# EAGLE design F3-Hexa-Brushed-SIDE-USB (EAGLE 7.5.0)
Title: F3 Hexa Brushed - Side USB Author: Lance Source: Alienflight.com License: CC BY SA <http://creativecommons.org/licenses/by-sa/4.0/>
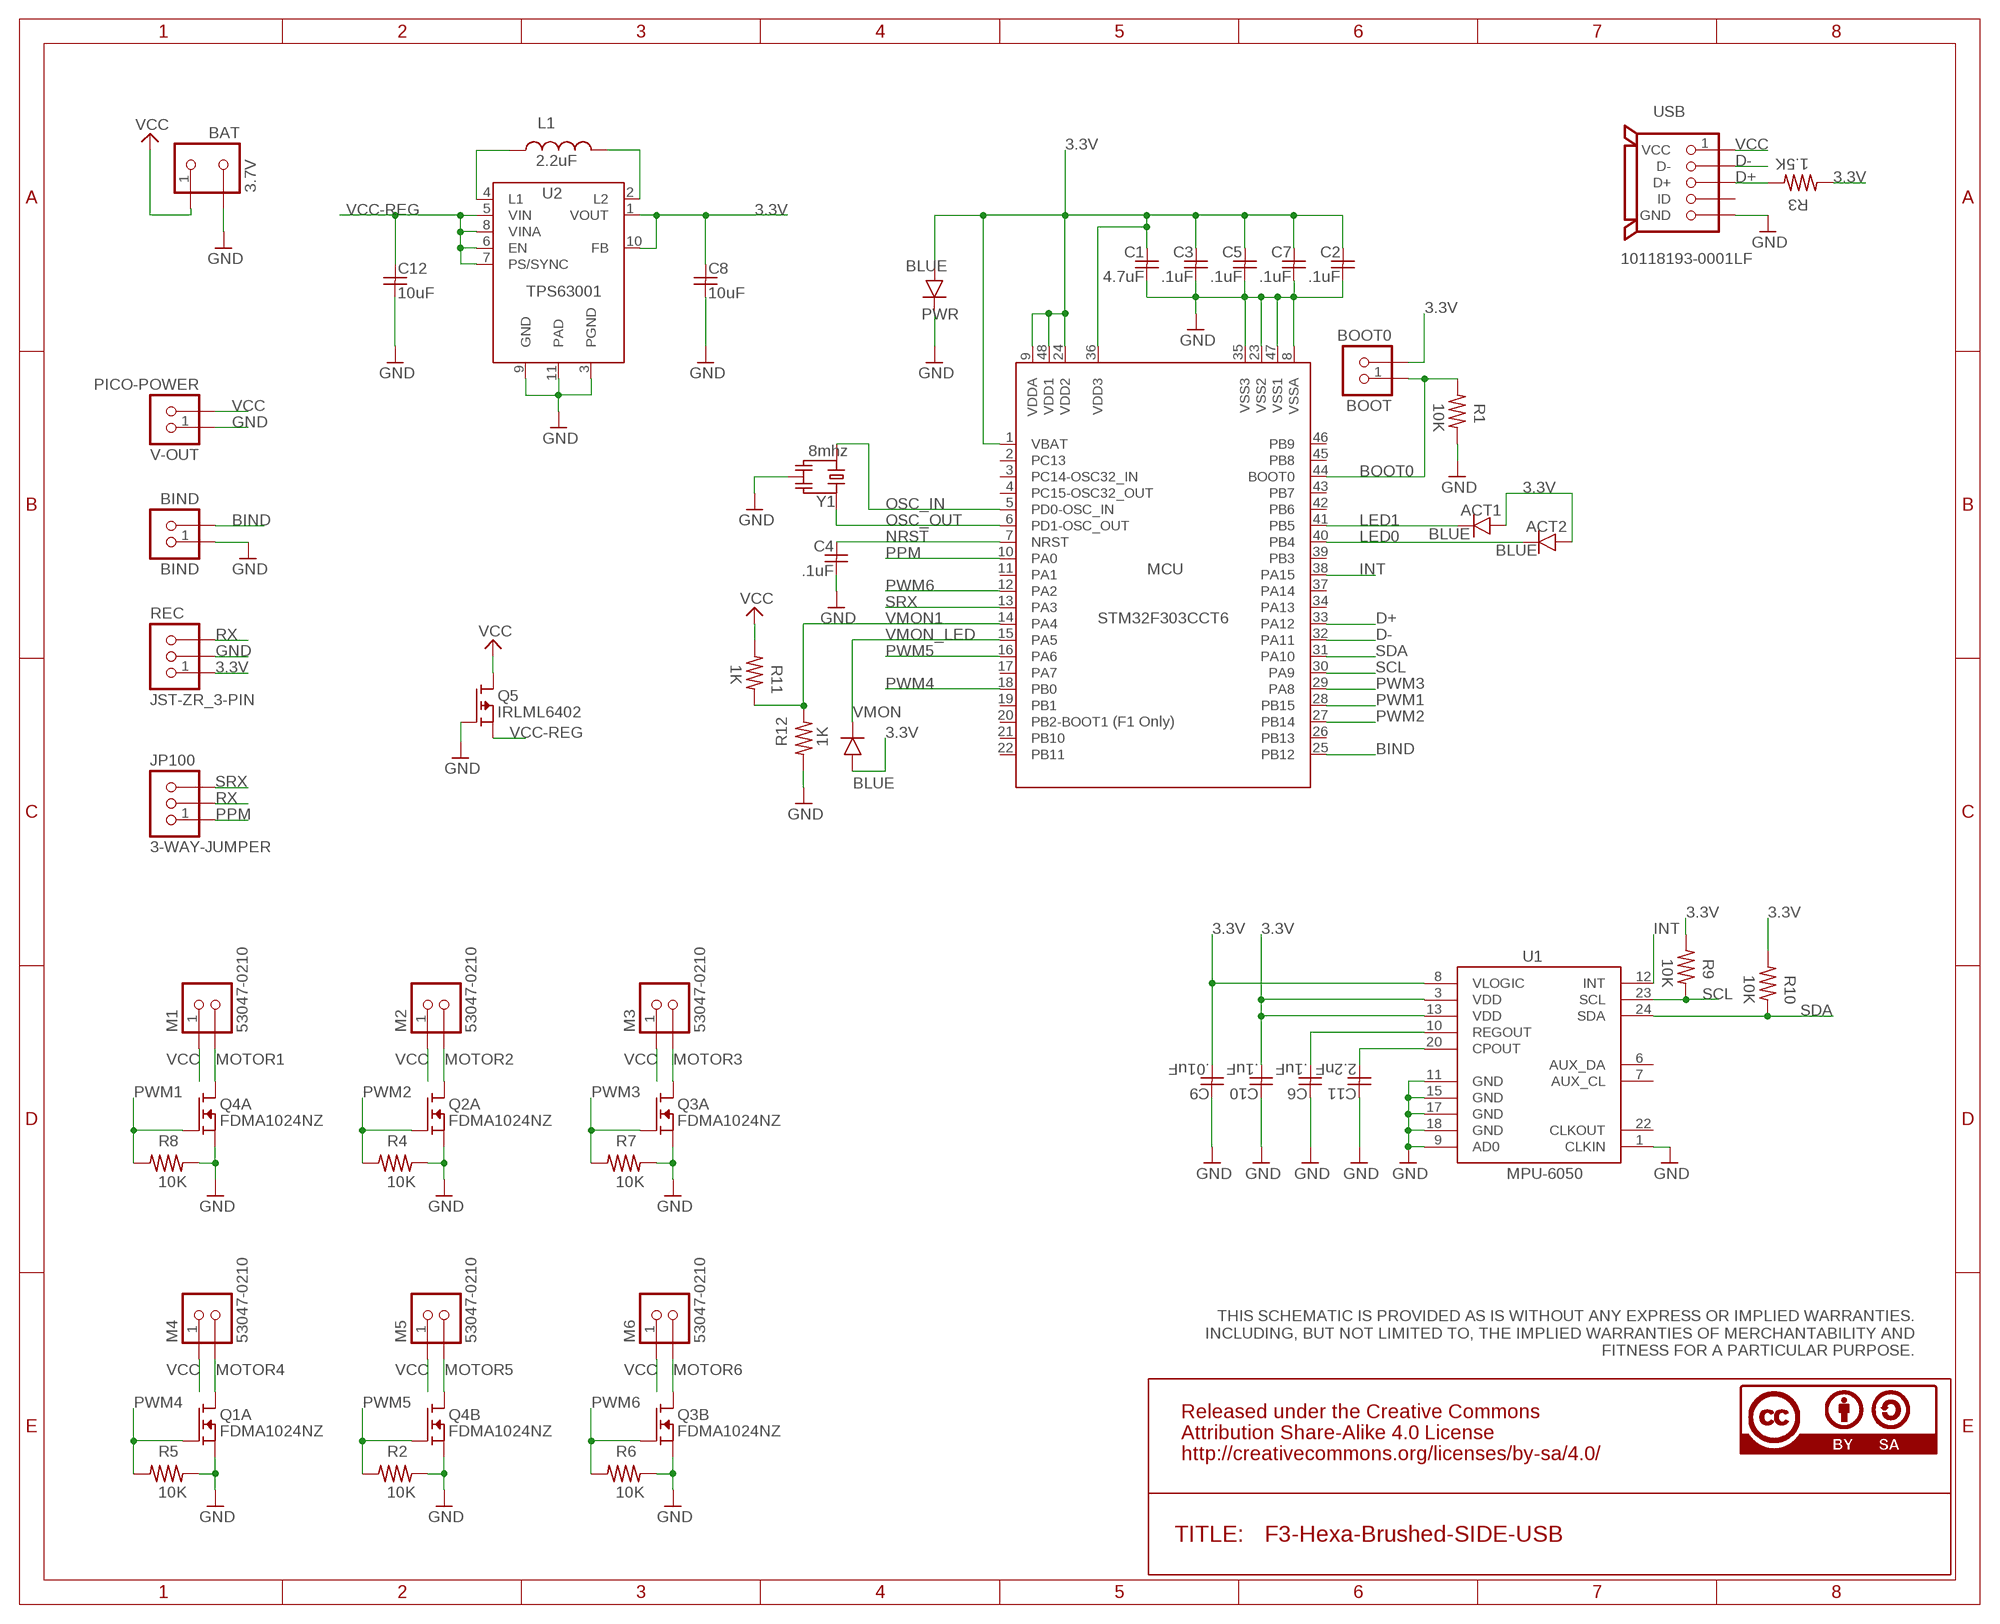
[diagram p0: schematic, sheet 1]

## Parts
ACT1  BLUE  SMD-CHIP-LED-0805  [SMD-CHIP-LED-0805]
ACT2  BLUE  SMD-CHIP-LED-0805  [SMD-CHIP-LED-0805]
BAT  3.7V  JST-PH-BAT  [S2B-PH-K-S]
BIND  BIND  TACTILE-SWITCH  [B3U-1000P(M)]
BOOT  BOOT0  TACTILE-SWITCH  [B3U-1000P(M)]
C1  4.7uF  CAPACITOR4.7UF  [MUR-CAP-0603]
C2  .1uF  CAPACITOR.1UF  [MUR-CAP-0603]
C3  .1uF  CAPACITOR.1UF  [MUR-CAP-0603]
C4  .1uF  CAPACITOR.1UF  [MUR-CAP-0603]
C5  .1uF  CAPACITOR.1UF  [MUR-CAP-0603]
C6  .1uF  CAPACITOR.1UF  [MUR-CAP-0603]
C7  .1uF  CAPACITOR.1UF  [MUR-CAP-0603]
C8  10uF  CAPACITOR10UF  [YUDEN-CAP-0805]
C9  .01uF  CAPACITOR.01UF  [MUR-CAP-0603]
C10  .1uF  CAPACITOR.1UF  [MUR-CAP-0603]
C11  2.2nF  CAPACITOR2.2NF  [MUR-CAP-0603]
C12  10uF  CAPACITOR10UF  [YUDEN-CAP-0805]
JP100  3-WAY-JUMPER  [3-WAY-JUMPER]
L1  2.2uF  NR301X  [NR301X]
M1  53047-0210  PICO-1.25-MOTOR  [PICO-53047-02]
M2  53047-0210  PICO-1.25-MOTOR  [PICO-53047-02]
M3  53047-0210  PICO-1.25-MOTOR  [PICO-53047-02]
M4  53047-0210  PICO-1.25-MOTOR  [PICO-53047-02]
M5  53047-0210  PICO-1.25-MOTOR  [PICO-53047-02]
M6  53047-0210  PICO-1.25-MOTOR  [PICO-53047-02]
MCU  STM32F303CCT6  STM32FX03-F3  [LQFP48-7X7]
PWR  BLUE  SMD-CHIP-LED-0805  [SMD-CHIP-LED-0805]
Q1  FDMA1024NZ  [MICROFET-2X2_DUAL]
Q2  FDMA1024NZ  [MICROFET-2X2_DUAL]
Q3  FDMA1024NZ  [MICROFET-2X2_DUAL]
Q4  FDMA1024NZ  [MICROFET-2X2_DUAL]
Q5  IRLML6402  MOSFET-P  [SOT-23]
R1  10K  RESISTOR10K  [VISH-RES-0603]
R2  10K  RESISTOR10K  [VISH-RES-0603]
R3  1.5K  RESISTOR1.5K  [VISH-RES-0603]
R4  10K  RESISTOR10K  [VISH-RES-0603]
R5  10K  RESISTOR10K  [VISH-RES-0603]
R6  10K  RESISTOR10K  [VISH-RES-0603]
R7  10K  RESISTOR10K  [VISH-RES-0603]
R8  10K  RESISTOR10K  [VISH-RES-0603]
R9  10K  RESISTOR10K  [VISH-RES-0603]
R10  10K  RESISTOR10K  [VISH-RES-0603]
R11  1K  RESISTOR1K  [VISH-RES-0603]
R12  1K  RESISTOR1K  [VISH-RES-0603]
REC  JST-ZR_3-PIN  [S3B-ZR]
U1  MPU-6050  [QFN24-4X4]
U2  TPS63001  TPS630XX-TPS63001  [VSON-N10]
USB  10118193-0001LF  USB-MICRO-B-FCI  [10118193-0001LF]
V-OUT  PICO-POWER  [PICO_1.25_.5MM]
VMON  BLUE  SMD-CHIP-LED-0805  [SMD-CHIP-LED-0805]
Y1  8mhz  RESONATOR8MHZ  [RESONATOR_8]

## Nets
3.3V: ACT1.A ACT2.A BOOT.2 C1.1 C2.1 C3.1 C5.1 C7.1 C8.1 C9.2 C10.2 MCU.1(VBAT) MCU.9(VDDA) MCU.24(VDD2) MCU.36(VDD3) MCU.48(VDD1) PWR.A R3.2 R9.2 R10.2 REC.1 U1.3(VDD) U1.8(VLOGIC) U1.13(VDD) U2.1(VOUT) U2.10(FB) VMON.A
BIND: BIND.2 MCU.25(PB12)
BOOT0: BOOT.1 MCU.44(BOOT0) R1.2
D+: MCU.33(PA12) R3.1 USB.3(D+)
D-: MCU.32(PA11) USB.2(D-)
GND: BAT.2 BIND.1 C1.2 C2.2 C3.2 C4.2 C5.2 C6.1 C7.2 C8.2 C9.1 C10.1 C11.1 C12.2 MCU.8(VSSA) MCU.23(VSS2) MCU.35(VSS3) MCU.47(VSS1) PWR.C Q1.A.S(A:S) Q2.A.S(A:S) Q3.A.S(A:S) Q3.B.S(B:S) Q4.A.S(A:S) Q4.B.S(B:S) Q5.1(G) R1.1 R2.1 R4.1 R5.1 R6.1 R7.1 R8.1 R12.2 REC.2 U1.1(CLKIN) U1.9(AD0) U1.11(GND) U1.15(GND) U1.17(GND) U1.18(GND) U2.3(PGND) U2.9(GND) U2.11(PAD) USB.5(GND) USB.GND USB.GND2(GND) USB.HOLE1(GND) USB.HOLE2(GND) V-OUT.1 Y1.2
INT: MCU.38(PA15) U1.12(INT)
LED0: ACT2.C MCU.40(PB4)
LED1: ACT1.C MCU.41(PB5)
MOTOR1: M1.2 Q4.A.D1(A:D) Q4.A.D(A:D)
MOTOR2: M2.2 Q2.A.D1(A:D) Q2.A.D(A:D)
MOTOR3: M3.2 Q3.A.D1(A:D) Q3.A.D(A:D)
MOTOR4: M4.2 Q1.A.D1(A:D) Q1.A.D(A:D)
MOTOR5: M5.2 Q4.B.D1(B:D) Q4.B.D(B:D)
MOTOR6: M6.2 Q3.B.D1(B:D) Q3.B.D(B:D)
N$1: C6.2 U1.10(REGOUT)
N$7: C11.2 U1.20(CPOUT)
N$8: L1.2 U2.2(L2)
N$9: L1.1 U2.4(L1)
NRST: C4.1 MCU.7(NRST)
OSC_IN: MCU.5(PD0-OSC_IN) Y1.3
OSC_OUT: MCU.6(PD1-OSC_OUT) Y1.1
PPM: JP100.1 MCU.10(PA0)
PWM1: MCU.28(PB15) Q4.A.G(A:G) R8.2
PWM2: MCU.27(PB14) Q2.A.G(A:G) R4.2
PWM3: MCU.29(PA8) Q3.A.G(A:G) R7.2
PWM4: MCU.18(PB0) Q1.A.G(A:G) R5.2
PWM5: MCU.16(PA6) Q4.B.G(B:G) R2.2
PWM6: MCU.12(PA2) Q3.B.G(B:G) R6.2
RX: JP100.2 REC.3
SCL: MCU.30(PA9) R9.1 U1.23(SCL)
SDA: MCU.31(PA10) R10.1 U1.24(SDA)
SRX: JP100.3 MCU.13(PA3)
VCC [vcc]: BAT.1 M1.1 M2.1 M3.1 M4.1 M5.1 M6.1 Q5.3(D) R11.2 USB.1(VCC) V-OUT.2
VCC-REG [vcc]: C12.1 Q5.2(S) U2.5(VIN) U2.6(EN) U2.7(PS/SYNC) U2.8(VINA)
VMON1: MCU.14(PA4) R11.1 R12.1
VMON_LED: MCU.15(PA5) VMON.C
Unconnected: MCU.2(PC13) MCU.3(PC14-OSC32_IN) MCU.4(PC15-OSC32_OUT) MCU.11(PA1) MCU.17(PA7) MCU.19(PB1) MCU.20(PB2-BOOT1) MCU.21(PB10) MCU.22(PB11) MCU.26(PB13) MCU.34(PA13) MCU.37(PA14) MCU.39(PB3) MCU.42(PB6) MCU.43(PB7) MCU.45(PB8) MCU.46(PB9) Q1.B.D1(B:D) Q1.B.D(B:D) Q1.B.G(B:G) Q1.B.S(B:S) Q2.B.D1(B:D) Q2.B.D(B:D) Q2.B.G(B:G) Q2.B.S(B:S) U1.6(AUX_DA) U1.7(AUX_CL) U1.22(CLKOUT) USB.4(ID)

## Notes on the sheet
- THIS SCHEMATIC IS PROVIDED AS IS WITHOUT ANY EXPRESS OR IMPLIED WARRANTIES.
   INCLUDING, BUT NOT LIMITED TO, THE IMPLIED WARRANTIES OF MERCHANTABILITY AND
   FITNESS FOR A PARTICULAR PURPOSE.

## Library data of the parts
ACT1 ACT2 PWR VMON = alienflight:SMD-CHIP-LED-0805: SMD CHIP LED APHCM2012QBC/D-F01 View Datasheet <https://www.kingbrightusa.com/images/catalog/spec/APHCM2012QBC-D-F01.pdf> Author: Lance Source: http://alienflight.com License: CC BY SA <creativecommons.org/licenses/by-sa/4.0/>; MF: Kingbright; MPN: APHCM2012QBC/D-F01
BAT = alienflight:JST-PH-BAT: Battery Connector JST- S2B-PH-K-S View Datasheet <http://www.jst-mfg.com/product/pdf/eng/ePH.pdf> Author: Lance Source: http://alienflight.com License: CC BY SA <creativecommons.org/licenses/by-sa/4.0/>; MF: JST; MPN: S2B-PH-K-S
BIND BOOT = alienflight:TACTILE-SWITCH: Tactile Switch B3U-1000P Datasheet <https://www.omron.com/ecb/products/pdf/en-b3u.pdf> Author: Lance Source: http://alienflight.com License: CC BY SA <creativecommons.org/licenses/by-sa/4.0/>; MF: Omron; MPN: B3U-1000P
C1 = alienflight:CAPACITOR: CAPACITORS Murata Datasheet <http://www.murata.com/~/media/webrenewal/support/library/catalog/products/capacitor/mlcc/c02e.ashx?la=en-us> Taiyo Yuden Datasheet <http://www.mouser.com/ds/2/396/mlcc11_hq_e-541564.pdf> Author: Lance Source: http://alienflight.com License: CC BY SA <creativecommons.org/licenses/by-sa/4.0/>; MF: Murata; MPN: GRJ188C70J475KE11D
C2-C7 C10 = alienflight:CAPACITOR: CAPACITORS Murata Datasheet <http://www.murata.com/~/media/webrenewal/support/library/catalog/products/capacitor/mlcc/c02e.ashx?la=en-us> Taiyo Yuden Datasheet <http://www.mouser.com/ds/2/396/mlcc11_hq_e-541564.pdf> Author: Lance Source: http://alienflight.com License: CC BY SA <creativecommons.org/licenses/by-sa/4.0/>; MF: Murata; MPN: GRM188R71C104KA01D
C8 C12 = alienflight:CAPACITOR: CAPACITORS Murata Datasheet <http://www.murata.com/~/media/webrenewal/support/library/catalog/products/capacitor/mlcc/c02e.ashx?la=en-us> Taiyo Yuden Datasheet <http://www.mouser.com/ds/2/396/mlcc11_hq_e-541564.pdf> Author: Lance Source: http://alienflight.com License: CC BY SA <creativecommons.org/licenses/by-sa/4.0/>; MF: Taiyo Yuden; MPN: JMK212AB7106KG-T
C9 = alienflight:CAPACITOR: CAPACITORS Murata Datasheet <http://www.murata.com/~/media/webrenewal/support/library/catalog/products/capacitor/mlcc/c02e.ashx?la=en-us> Taiyo Yuden Datasheet <http://www.mouser.com/ds/2/396/mlcc11_hq_e-541564.pdf> Author: Lance Source: http://alienflight.com License: CC BY SA <creativecommons.org/licenses/by-sa/4.0/>; MF: Murata; MPN: GRM188R71C103KA01D
C11 = alienflight:CAPACITOR: CAPACITORS Murata Datasheet <http://www.murata.com/~/media/webrenewal/support/library/catalog/products/capacitor/mlcc/c02e.ashx?la=en-us> Taiyo Yuden Datasheet <http://www.mouser.com/ds/2/396/mlcc11_hq_e-541564.pdf> Author: Lance Source: http://alienflight.com License: CC BY SA <creativecommons.org/licenses/by-sa/4.0/>; MF: Murata; MPN: GRM188R71C222KA01D
JP100 = alienflight:3-WAY-JUMPER: 3 Way Jumper
L1 = alienflight:NR301X: 3X3mm Inductor NR3015T2R2M - Datasheet <http://datasheet.octopart.com/NR3015T2R2M-Taiyo-Yuden-datasheet-41181804.pdf> Author: Lance Source: http://alienflight.com License: CC BY SA <creativecommons.org/licenses/by-sa/4.0/>; MF: Taiyo Yuden; MPN: NR3015T2R2M
M1-M6 = alienflight:PICO-1.25-MOTOR: Motor Connector PicoBlade 1.25 53047-02 View Datasheet <http://www.molex.com/webdocs/datasheets/pdf/en-us/0530470210_PCB_HEADERS.pdf> Author: Lance Source: http://alienflight.com License: CC BY SA <creativecommons.org/licenses/by-sa/4.0/>; MF: MOLEX; MPN: 53047-0210
MCU = alienflight:STM32FX03: STM32F32FX03 Datasheet <http://www.st.com/web/en/resource/technical/document/datasheet/DM00058181.pdf> Author: Lance Source: http://alienflight.com License: CC BY SA <creativecommons.org/licenses/by-sa/4.0/>; MF: ST; MPN: STM32F303CCT6
Q1-Q4 = alienflight:FDMA1024NZ: Dual N-Channel MOSFET FDMA1024NZ View Datasheet <https://www.fairchildsemi.com/datasheets/FD/FDMA1024NZ.pdf> Author: Lance Source: Alienflight.com License: CC BY SA <creativecommons.org/licenses/by-sa/4.0/>; MF: Fairchild; MPN: FDMA1024NZ
Q5 = alienflight:MOSFET-P: P-Channel MOSFET IRLML6402 Datasheet <http://www.irf.com/product-info/datasheets/data/irlml6402pbf.pdf> Author: Lance Source: Alienflight.com License: CC BY SA <creativecommons.org/licenses/by-sa/4.0/>; MF: IR; MPN: IRLML6402
R1 R2 R4-R10 = alienflight:RESISTOR: RESISTORS Vishay DataSheet <http://www.vishay.com/docs/20043/crcwhpe3.pdf> Author: Lance Source: http://alienflight.com License: CC BY SA <creativecommons.org/licenses/by-sa/4.0/>; MF: Vishay; MPN: CRCW060310K0FKEAHP
R3 = alienflight:RESISTOR: RESISTORS Vishay DataSheet <http://www.vishay.com/docs/20043/crcwhpe3.pdf> Author: Lance Source: http://alienflight.com License: CC BY SA <creativecommons.org/licenses/by-sa/4.0/>; MF: Vishay; MPN: CRCW06031K50FKEAHP
R11 R12 = alienflight:RESISTOR: RESISTORS Vishay DataSheet <http://www.vishay.com/docs/20043/crcwhpe3.pdf> Author: Lance Source: http://alienflight.com License: CC BY SA <creativecommons.org/licenses/by-sa/4.0/>; MF: Vishay; MPN: CRCW06031K00FKEAHP
REC = alienflight:JST-ZR_3-PIN: 3 Pin Receiver JST - S3B-ZR View Datasheet <http://www.jst-mfg.com/product/pdf/eng/eZH.pdf> Author: Lance Source: http://alienflight.com License: CC BY SA <creativecommons.org/licenses/by-sa/4.0/>; MF: JST; MPN: S3B-ZR
U1 = alienflight:MPU-6050: MPU-6050 View Datasheet <http://43zrtwysvxb2gf29r5o0athu.wpengine.netdna-cdn.com/wp-content/uploads/2015/02/MPU-6000-Datasheet1.pdf> Author: Lance Source: http://alienflight.com License: CC BY SA <creativecommons.org/licenses/by-sa/4.0/>; MF: Invensense; MPN: MPU-6050
U2 = alienflight:TPS630XX: Buck/Boost Converter TPS63001/2 Datasheet <http://www.ti.com/lit/ds/symlink/tps63001.pdf> Author: Lance Source: http://alienflight.com License: CC BY SA <creativecommons.org/licenses/by-sa/4.0/>; MF: TI; MPN: TPS63001DRCR
USB = alienflight:USB-MICRO-B: Micro-B USB Connector Author: Lance Source: http://alienflight.com License: CC BY SA <creativecommons.org/licenses/by-sa/4.0/>; MF: FCI; MPN: 10118193-0001LF
V-OUT = alienflight:PICO-POWER: Pico Power Connector Picoblade 53047-0210 View Datasheet <http://www.molex.com/webdocs/datasheets/pdf/en-us/0530470210_PCB_HEADERS.pdf> Author: Lance Source: http://alienflight.com License: CC BY SA <creativecommons.org/licenses/by-sa/4.0/>; MF: Molex; MPN: 53047-0210
Y1 = alienflight:RESONATOR: SMD Ceramic Resonators Ceralock Murata Datasheet <http://www.murata.com/~/media/webrenewal/support/library/catalog/products/timingdevice/ceralock/p16e.ashx> Author: Lance Source: http://alienflight.com License: CC BY SA <creativecommons.org/licenses/by-sa/4.0/>; MF: Murata; MPN: CSTCE8M00G55-R0

## Net classes
0 default: width 0.254 mm, drill 0.33 mm, clearance 0.178 mm
1 vcc: width 0.254 mm, drill 0.33 mm, clearance 0.178 mm
2 gnd: width 0.254 mm, drill 0.33 mm, clearance 0.178 mm

## Board
Title: F3 Hexa Brushed - Side USB Author: Lance Source: Alienflight.com License: CC BY SA <http://creativecommons.org/licenses/by-sa/4.0/>
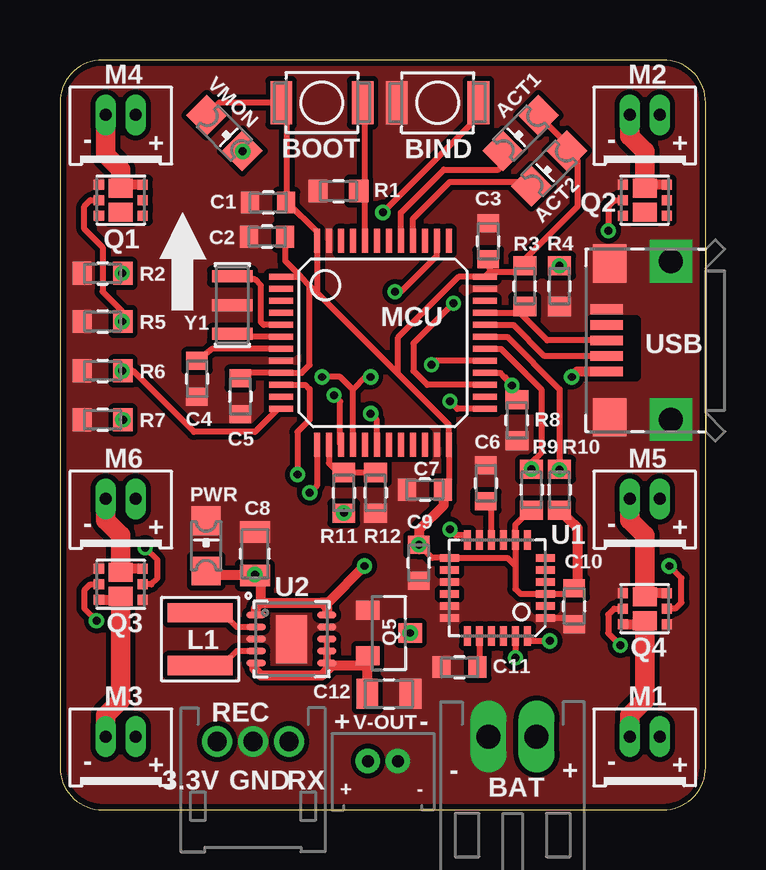
[diagram p1: board, top side]
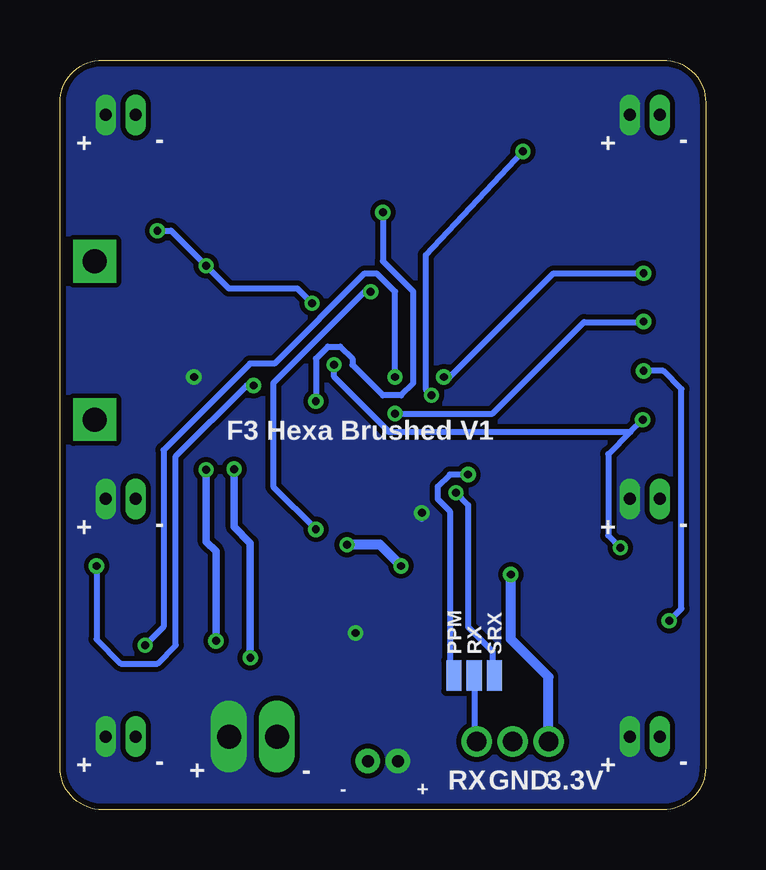
[diagram p2: board, bottom side, seen from below]

Size 26.92 x 31.24 mm. Coordinates in mm from the lower left corner, seen from the top.
Outline: 26.92,1.78 26.92,29.46 arc90 25.15,31.24 1.78,31.24 arc90 0,29.46 0,1.78 arc90 1.78,0 25.15,0 arc90 26.92,1.78
Copper layers (1*16): Top 0.035mm / dielectric 1.5mm / Bottom 0.035mm
Design rules "Alien-Design-Rules": minimum track width 6mil, minimum drill 12mil, track to track 6mil, track to pad 6mil, pad to pad 6mil, via to via 6mil, smd to smd 0mil, copper to edge 10mil, drill to drill 10mil, minimum pad ring 7mil, minimum via ring 6mil, stop-mask expansion 0mil, vias tented up to drill 20mil, thermal gap 10mil

### Footprints (pad centres in the part's own frame; a part is rotated, then mirrored left to right if it is on the bottom)
SMD-CHIP-LED-0805 = smd 1.2 x 1.2: A -1.05,0; C 1.05,0
S2B-PH-K-S = drill 1 long: 1 1,0; 2 -1,0
B3U-1000P(M) = smd 0.9 x 1.8: 1 -1.7,0; 2 1.7,0
MUR-CAP-0603 = smd 0.75 x 0.9: 1 -0.75,0; 2 0.75,0
YUDEN-CAP-0805 = smd 0.9 x 1.25: 1 -0.9,0; 2 0.9,0
3-WAY-JUMPER = smd 0.635 x 1.27: 1 -0.84,0; 2 0,0; 3 0.84,0
NR301X = smd 2.7 x 0.8: 1 0,1.1; 2 0,-1.1
PICO-53047-02 = drill 0.5 pad 0.813 long: 1 0.625,0; 2 -0.625,0
LQFP48-7X7 = smd 0.254 x 1: 1 -2.75,-4.25; 2 -2.25,-4.25; 3 -1.75,-4.25; 4 -1.25,-4.25; 5 -0.75,-4.25; 6 -0.25,-4.25; 7 0.25,-4.25; 8 0.75,-4.25; 9 1.25,-4.25; 10 1.75,-4.25; 11 2.25,-4.25; 12 2.75,-4.25; 25 2.75,4.25; 26 2.25,4.25; 27 1.75,4.25; 28 1.25,4.25; 29 0.75,4.25; 30 0.25,4.25; 31 -0.25,4.25; 32 -0.75,4.25; 33 -1.25,4.25; 34 -1.75,4.25; 35 -2.25,4.25; 36 -2.75,4.25 | smd 1 x 0.254: 13 4.25,-2.75; 14 4.25,-2.25; 15 4.25,-1.75; 16 4.25,-1.25; 17 4.25,-0.75; 18 4.25,-0.25; 19 4.25,0.25; 20 4.25,0.75; 21 4.25,1.25; 22 4.25,1.75; 23 4.25,2.25; 24 4.25,2.75; 37 -4.25,2.75; 38 -4.25,2.25; 39 -4.25,1.75; 40 -4.25,1.25; 41 -4.25,0.75; 42 -4.25,0.25; 43 -4.25,-0.25; 44 -4.25,-0.75; 45 -4.25,-1.25; 46 -4.25,-1.75; 47 -4.25,-2.25; 48 -4.25,-2.75
MICROFET-2X2_DUAL = smd 0.8 x 1: A.D 0.5,0; B.D -0.5,0 | smd 0.42 x 0.42: A.D1 0.65,-0.915; A.G 0,0.915; A.S 0.65,0.915; B.D1 -0.65,0.915; B.G 0,-0.915; B.S -0.65,-0.915
SOT-23 = smd 0.802 x 0.972: 1 -0.95,-0.885; 2 0.95,-0.885; 3 0,0.885
VISH-RES-0603 = smd 0.8 x 0.95: 1 -0.85,0; 2 0.85,0
S3B-ZR = drill 0.8 pad 1.27: 1 -1.5,0; 2 0,0; 3 1.5,0
QFN24-4X4 = smd 0.8 x 0.3: 1 -2,1.25; 2 -2,0.75; 3 -2,0.25; 4 -2,-0.25; 5 -2,-0.75; 6 -2,-1.25; 13 2,-1.25; 14 2,-0.75; 15 2,-0.25; 16 2,0.25; 17 2,0.75; 18 2,1.25 | smd 0.3 x 0.8: 7 -1.25,-2; 8 -0.75,-2; 9 -0.25,-2; 10 0.25,-2; 11 0.75,-2; 12 1.25,-2; 19 1.25,2; 20 0.75,2; 21 0.25,2; 22 -0.25,2; 23 -0.75,2; 24 -1.25,2
VSON-N10 = smd 0.8 x 0.26: 1 -1.475,1; 2 -1.475,0.5; 3 -1.475,0; 4 -1.475,-0.5; 5 -1.475,-1; 6 1.475,-1; 7 1.475,-0.5; 8 1.475,0; 9 1.475,0.5; 10 1.475,1 | smd 1.3 x 2: 11 0,0
10118193-0001LF = smd 0.4 x 1.35: 1 1.3,-4.125; 2 0.65,-4.125; 3 0,-4.125; 4 -0.65,-4.125; 5 -1.3,-4.125 | smd 1.6 x 1.4: GND -3.2,-4; GND2 3.2,-4 | drill 1 pad 1.778 square: HOLE1 -3.3,-1.45; HOLE2 3.3,-1.45
PICO_1.25_.5MM = drill 0.5 pad 1.016: 1 0.625,0; 2 -0.625,0
RESONATOR_8 = smd 0.5 x 1.7: 1 -1.2,0; 2 0,0; 3 1.2,0

### Placement (x,y rotation side)
ACT1  19.2,28.19 225 top
ACT2  20.4,26.72 225 top
BAT  18.87,3.05 0 top
BIND  15.75,29.46 0 top
BOOT  10.92,29.46 180 top
C1  8.69,25.3 180 top
C2  8.64,23.88 180 top
C3  17.86,23.7 90 top
C4  5.71,17.96 270 top
C5  7.52,17.22 270 top
C6  17.75,13.61 270 top
C7  15.21,13.34 180 top
C8  8.13,10.67 90 top
C9  14.96,10.29 90 top
C10  21.44,8.48 90 top
C11  16.66,5.94 0 top
C12  13.72,4.83 0 top
JP100  9.65,5.59 0 bottom
L1  5.84,7.11 180 top
M1  24.38,3.05 0 top
M2  24.38,28.96 0 top
M3  2.54,3.05 0 top
M4  2.54,28.96 0 top
M5  24.38,12.95 0 top
M6  2.54,12.95 0 top
MCU  13.46,19.46 270 top
PWR  6.1,11 90 top
Q1  2.54,25.4 90 top
Q2  24.38,25.4 90 top
Q3  2.54,9.4 270 top
Q4  24.38,8.38 270 top
Q5  13.72,7.37 270 top
R1  11.61,25.78 0 top
R2  1.78,22.35 0 top
R3  19.38,21.82 90 top
R4  20.83,21.82 90 top
R5  1.78,20.35 0 top
R6  1.78,18.29 0 top
R7  1.78,16.26 0 top
R8  19.05,16.23 90 top
R9  19.66,13.34 270 top
R10  20.83,13.34 270 top
R11  11.84,13.21 270 top
R12  13.16,13.21 270 top
REC  8.05,2.84 0 top
U1  18.24,9.25 180 top
U2  9.65,7.11 0 top
U$1  [ARROW]  5.08,22.35 0 top
USB  26.92,19.56 270 top
V-OUT  13.46,2.03 0 top
VMON  6.86,28.19 315 top
Y1  7.19,21.03 90 top

### Tracks (layer width: path | path; a pad name or v marks a point on that pad's centre or on a via)
3.3V  (via drill 0.33)
  Top 0.254: 21.51,9.26 C10.2 21.49,9 U1.3 19.2,9 18.99,9.21 18.99,10.16 | 18.99,10.16 U1.8 18.99,11.88 19.56,12.45 19.65,12.45 R9.2 | 18.99,10.16 18.65,10.5 U1.13 15.51,10.5 v14.96,11.05 | C3.1 17.93,22.43 | 17.93,22.43 MCU.36 16.62,22.21 14.1,19.68 14.1,18.16 | 10.71,21.55 MCU.48 10.71,24.09 9.5,25.3 C1.1 9.44,29.16 | 10.41,21.84 10.41,18.54 10.08,18.21 MCU.9 7.75,18.21 C5.1 | 17.93,22.43 19.14,22.43 R3.2 19.38,22.94 21.59,25.15 21.59,27.06 ACT2.A 21.24,27.64 ACT1.A | 14.96,10.9 14.99,10.92 14.99,10.81 14.97,10.81 v14.96,11.05 | 14.99,10.77 v14.96,11.05 | v14.96,11.05 C9.2 15.04,10.96 15.04,10.92 | 14.1,18.16 16.21,16.05 MCU.24 16.21,13.58 C7.1 | 14.1,18.16 10.71,21.55 | MCU.1 10.05,22.21 | 10.05,22.21 10.41,21.84 | 10.41,21.84 10.71,21.55 | 9.44,29.16 BOOT.2 9.44,29.16 | 9.44,29.16 9.14,29.46 6.64,29.46 VMON.A | U2.10 11.13,8.15 11.15,8.18 | 8.18,8.23 8.18,8.25 U2.1 8.14,8.11 8.13,8.13 | C2.1 9.39,22.87 10.05,22.21
  Top 0.305: 14.99,10.81 14.94,10.85
  Top 0.406: 21.59,9.4 21.59,11.75 R10.2 | 8.38,8.64 10.92,8.64 | 11.15,8.18 11.15,8.41 10.92,8.64 | 8.18,8.23 8.18,8.43 8.38,8.64 | 8.38,8.64 8.38,9.51 C8.1 | C8.1 6.28,9.77 PWR.A | v12.7,10.16 11.18,8.64 10.92,8.64 | 14.99,10.92 14.99,11.68 16,12.7 16,13.3 C7.1 | C8.1 v8.13,9.8
  Top 0.508: 21.49,9.14 C10.2 21.44,9.3 21.59,9.4
  Bottom 0.406: v12.7,10.16 13.59,11.05 v14.96,11.05 | v8.13,9.8 8.13,7.11 6.55,5.54 REC.1
BIND  (via drill 0.33)
  Top 0.254: MCU.25 16.57,16.71 v16.26,17.02 | v13.46,24.89 17.5,28.93 BIND.2
  Bottom 0.254: v16.26,17.02 16.26,18.8 15.75,19.3 15.24,19.3 14.73,18.8 14.73,18.54 13.46,17.27 12.7,17.27 12.19,17.78 12.19,21.59 13.46,22.86 v13.46,24.89
BOOT0
  Top 0.254: MCU.44 12.71,25.4 | R1.2 12.71,25.4 | 12.71,25.4 12.71,29.3 BOOT.1
D+
  Top 0.254: MCU.33 19.12,20.71 | 19.12,20.71 R3.1 | 19.12,20.71 19.17,20.71 20.32,19.56 USB.3
D-
  Top 0.254: MCU.32 18.91,20.21 20.21,18.91 USB.2
GND
  Top 0.254: U1.1 21.33,8 C10.1 | U1.11 17.53,11.28
  pour Top (isolate 0.203, no thermals): 26.77,1.83 26.77,29.26 arc90 24.99,31.04 1.88,31.04 arc90 0.1,29.26 0.1,1.83 arc90 1.88,0.05 24.99,0.05 arc90
INT  (via drill 0.33)
  Top 0.254: U1.12 17.02,11.28 17.02,11.43 16.51,11.43 v16.26,11.68 | v13.97,21.59 14.22,21.59 15.71,23.08 MCU.38
  Bottom 0.254: v13.97,21.59 14.22,21.59 18.03,17.78 18.03,13.46 v16.26,11.68
LED0
  Top 0.254: MCU.40 14.71,24.62 16.26,26.16 19.58,26.16 ACT2.C
LED1
  Top 0.254: MCU.41 14.21,24.88 16,26.67 18.29,26.67 18.8,27.18 18.8,27.62 ACT1.C
MOTOR1
  Top 0.406: Q4.A.D1 24.23,7.73 Q4.A.D
  Top 0.813: M1.2 23.76,3.95 24.38,4.57 Q4.A.D
MOTOR2
  Top 0.406: Q2.A.D1 24.53,26.05 Q2.A.D
  Top 0.813: M2.2 23.76,28.06 24.38,27.43 Q2.A.D
MOTOR3
  Top 0.406: Q3.A.D1 2.39,8.75 Q3.A.D
  Top 0.813: M3.2 1.92,3.95 2.54,4.57 Q3.A.D
MOTOR4
  Top 0.406: Q1.A.D1 2.69,26.05 Q1.A.D
  Top 0.813: M4.2 1.92,27.3 2.54,26.67 Q1.A.D
MOTOR5
  Top 0.406: Q4.B.D1 24.53,9.03 Q4.B.D
  Top 0.813: M5.2 23.76,12.05 24.38,11.43 Q4.B.D
MOTOR6
  Top 0.406: Q3.B.D1 2.69,10.05 Q3.B.D
  Top 0.813: M6.2 1.92,12.05 2.54,11.43 Q3.B.D
N$1
  Top 0.254: U1.10 17.99,12.63 C6.2
N$7
  Top 0.254: U1.20 17.49,6.07 C11.2
N$8
  Top 0.254: U2.2 7.37,7.61 6.86,8.13 5.93,8.13 L1.2
N$9
  Top 0.254: U2.4 7.37,6.61 6.86,6.1 5.93,6.1 L1.1
NRST
  Top 0.254: MCU.7 6.34,19.21 C4.1
OSC_IN
  Top 0.254: Y1.3 7.27,22.15 7.27,22.1 8.13,22.1 8.38,21.84 8.38,20.32 8.5,20.21 MCU.5
OSC_OUT
  Top 0.254: MCU.6 7.26,19.71 Y1.1
PPM  (via drill 0.33)
  Top 0.254: MCU.10 10.23,17.71 10.41,17.53 10.41,16.26 9.91,15.75 v9.91,13.97
  Bottom 0.254: v9.91,13.97 10.67,13.97 11.18,13.46 11.18,12.95 10.67,12.45 10.67,5.76 JP100.1
PWM1  (via drill 0.33)
  Top 0.254: v18.85,17.68 18.54,18.03 | MCU.28 18.37,18.21 v18.85,17.68 | v25.4,10.16 25.91,9.65 25.91,8.64 25.65,8.38 Q4.A.G | R8.2 19.05,17.48 v18.85,17.68
  Bottom 0.254: v18.85,17.68 19.15,17.68 22.1,14.73 22.1,6.86 22.86,6.1 24.38,6.1 25.4,7.11 v25.4,10.16
PWM2  (via drill 0.33)
  Top 0.254: MCU.27 15.31,17.71 14.73,18.29 14.73,19.43 v16.41,21.11 | R4.2 20.83,22.86 | v22.86,24.13 22.86,25.15 23.11,25.4 Q2.A.G
  Bottom 0.254: v16.41,21.11 17.02,21.72 19.88,21.72 R4.2 22.29,24.13 v22.86,24.13
  other vias: 20.83,22.67
PWM3  (via drill 0.33)
  Top 0.254: MCU.29 15.66,18.71 v15.49,18.54 | R7.2 2.63,16.17 | v3.56,10.92 4.06,10.41 4.06,9.65 3.81,9.4 Q3.A.G
  Bottom 0.254: v15.49,18.54 15.49,18.03 13.21,15.75 3.14,15.75 | 3.14,15.75 4.06,14.82 4.06,11.43 v3.56,10.92 | 3.14,15.75 R7.2
  other vias: 2.63,16.26
PWM4  (via drill 0.33)
  Top 0.254: MCU.18 13.21,16.25 v12.95,16.51 | R5.2 2.59,20.32 v2.59,20.34 2.59,20.78 1.78,21.59 1.78,23.44 1.02,24.21 1.02,25.15 1.27,25.4 Q1.A.G
  Bottom 0.254: v12.95,16.51 8.89,16.51 5.08,20.32 2.87,20.32 v2.59,20.34
PWM5  (via drill 0.33)
  Top 0.254: MCU.16 12.21,17.51 | v23.37,6.86 22.86,7.37 22.86,8.13 23.11,8.38 Q4.B.G | 12.21,17.51 11.68,18.03 v10.92,18.03 | v12.95,18.03 12.74,18.03 12.21,17.51 | v2.59,22.35 2.62,22.43 R2.2
  Bottom 0.254: v12.95,18.03 12.95,21.59 13.72,22.35 14.22,22.35 17.98,18.59 19,18.59 22.61,14.99 22.61,7.62 v23.37,6.86 | v10.92,18.03 10.67,18.03 6.35,22.35 v2.59,22.35
PWM6  (via drill 0.33)
  Top 0.254: MCU.12 9.09,16.71 8.13,15.75 5.59,15.75 3.05,18.29 R6.2 v2.59,18.29 | v1.52,7.87 1.02,8.38 1.02,9.14 1.27,9.4 Q3.B.G
  Bottom 0.254: v1.52,7.87 1.02,8.38 1.02,17.53 1.78,18.29 v2.59,18.29
RX
  Bottom 0.254: JP100.2 9.65,2.94 REC.3
SCL  (via drill 0.33)
  Top 0.254: U1.23 v18.99,6.34 | MCU.30 18.39,19.21 20.07,17.53 20.07,14.86 19.66,14.45 v19.66,14.2
  Top 0.406: v19.66,14.2 R9.1
  Bottom 0.305: v18.99,6.34 18.99,11.11 19.66,11.79 v19.66,14.2
SDA  (via drill 0.33)
  Top 0.254: U1.24 19.7,7.04 v20.42,7.04 | MCU.31 18.65,19.71 20.83,17.53 v20.83,14.17
  Top 0.406: R10.1 v20.83,14.17
  Bottom 0.305: v20.42,7.04 20.42,10.77 20.83,11.18 v20.83,14.17
SRX  (via drill 0.33)
  Top 0.254: MCU.13 10.71,13.51 v10.41,13.21
  Bottom 0.254: v10.41,13.21 9.91,12.7 9.91,7.62 8.89,6.6 8.89,5.67 JP100.3
VCC  (via drill 0.33)
  Top 0.254: R11.2 v11.84,12.37
  Top 0.406: USB.1 21.56,18.26 v21.34,18.03 | Q5.3 14.82,7.2 14.73,7.37
  Bottom 0.254: v11.84,12.37 11.84,12.12
  other vias: 14.6,7.37
  pour Bottom (isolate 0.203, no thermals): 1.88,0.05 24.99,0.05 arc90 26.77,1.83 26.77,29.26 arc90 24.99,31.04 1.88,31.04 arc90 0.1,29.26 0.1,1.83 arc90
VCC-REG
  Top 0.254: U2.5 8.13,6.11 8.13,6.04 8.1,6.02 | U2.6 11.23,6.02 | U2.7 U2.8
  Top 0.305: U2.6 U2.7
  Top 0.406: 8.1,6.02 8.1,5.87 8.38,5.59 10.92,5.59 11.23,5.89 11.23,6.02 12.57,6.02 Q5.2 12.82,6.06 C12.1
VMON1
  Top 0.254: MCU.14 11.21,14.44 11.43,14.22 11.77,14.22 R11.1 R12.1
VMON_LED  (via drill 0.33)
  Top 0.254: MCU.15 11.68,15.23 11.68,17.02 v11.43,17.27 | v7.62,27.43 7.87,27.43 | 7.37,27.18 v7.62,27.43 | VMON.C v7.62,27.43
  Bottom 0.254: v7.62,27.43 11.68,23.11 11.68,17.53 v11.43,17.27

### Text on the board
tPlace: + | -
bPlace: SRX | RX | PPM
bNames: F3 Hexa Brushed V1
Guide: Released under the Creative Commons Attribution Share-Alike 4.0 License / http://creativecommons.org/licenses/by-sa/4.0/ | THIS BOARD DESIGN IS PROVIDED AS IS WITHOUT ANY EXPRESS OR IMPLIED WARRANTIES. / INCLUDING, BUT NOT LIMITED TO, THE IMPLIED WARRANTIES OF MERCHANTABILITY AND / FITNESS FOR A PARTICULAR PURPOSE.